# EAGLE schematic AnalogLedFader (EAGLE 6.4)
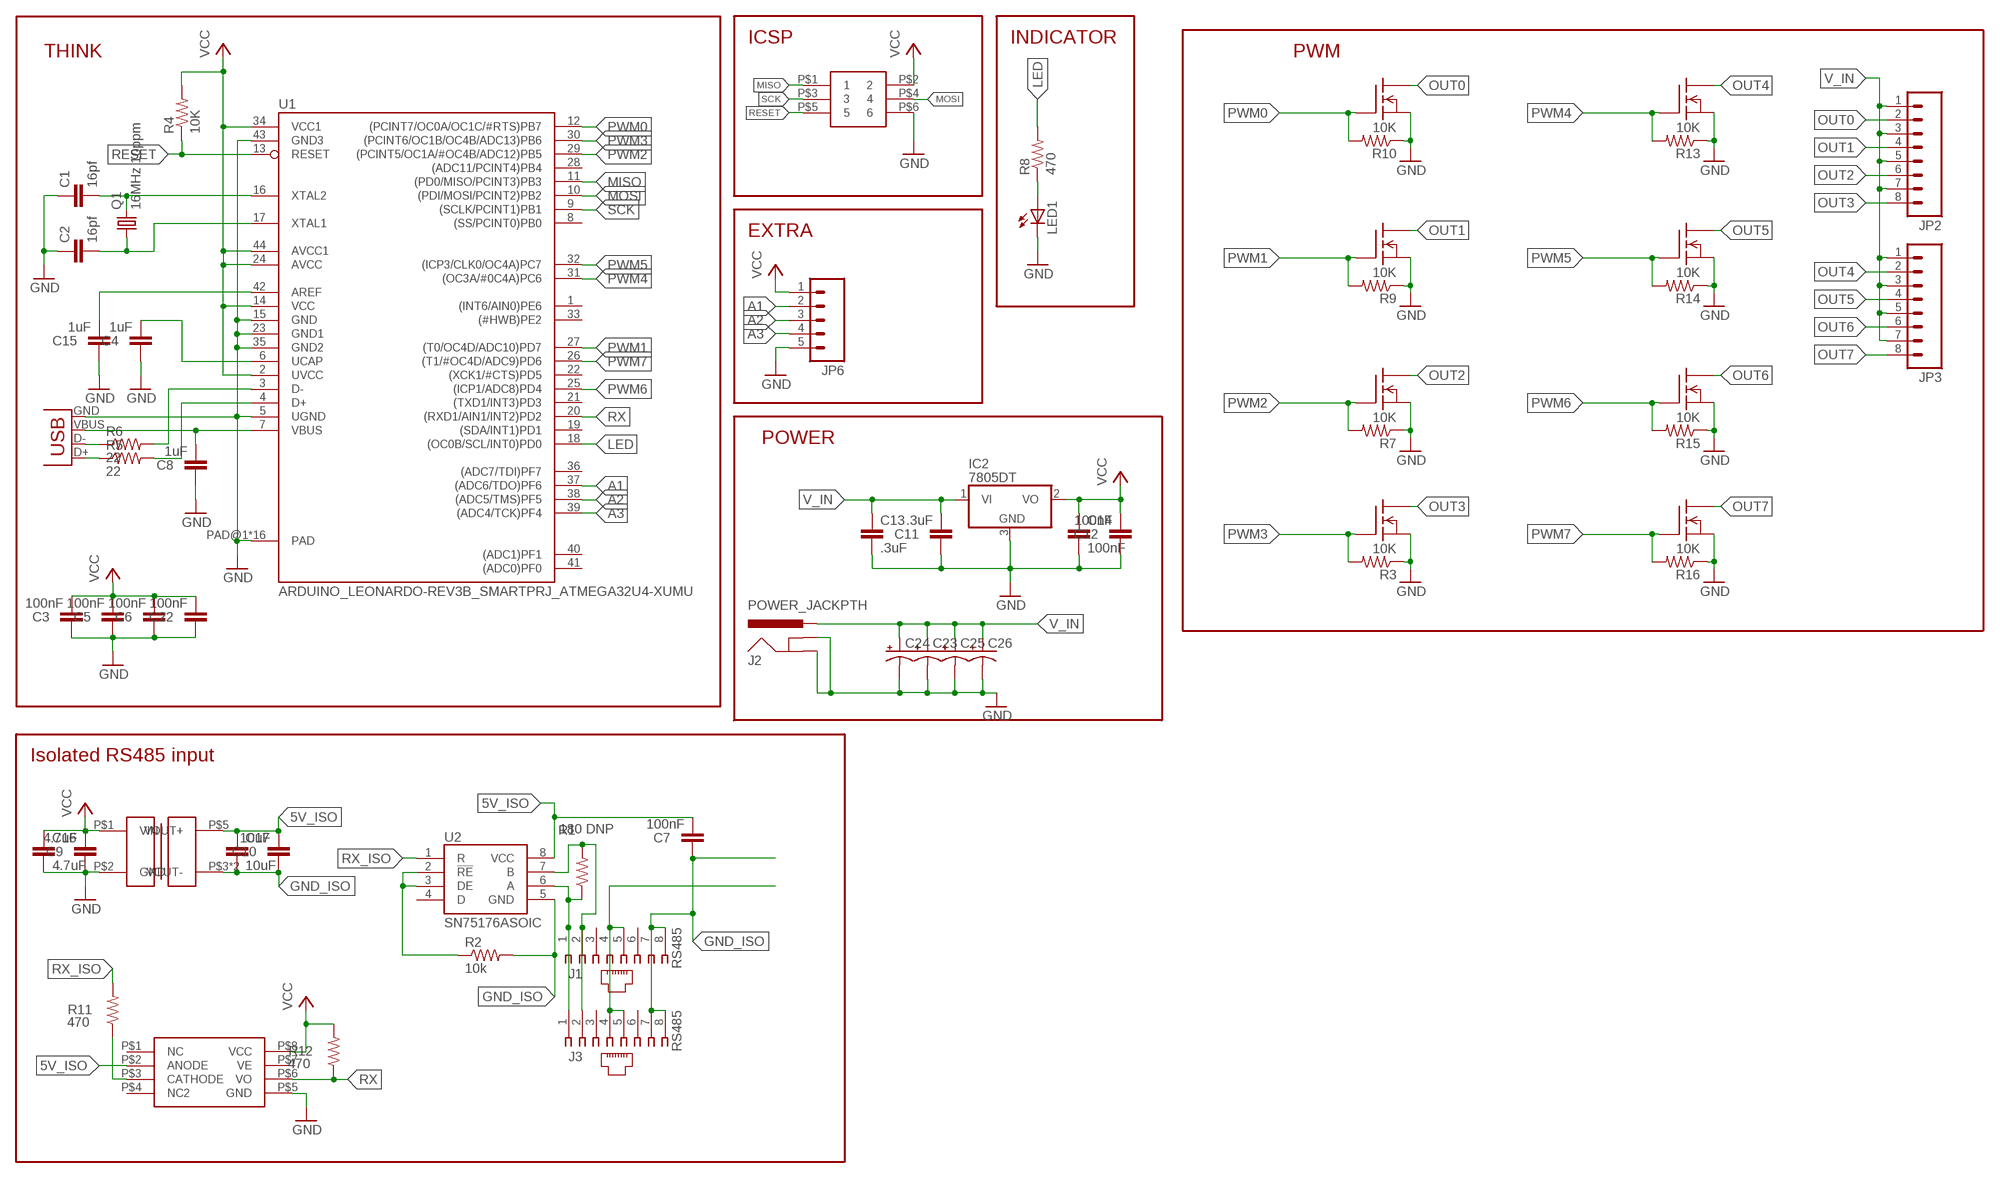
[diagram p0: schematic, sheet 1]

## Parts
C1  16pf  CAP0805  [0805]
C2  16pf  CAP0805  [0805]
C3  100nF  CAP0805  [0805]
C4  1uF  CAP0805  [0805]
C5  100nF  CAP0805  [0805]
C6  100nF  CAP0805  [0805]
C7  100nF  CAP0805  [0805]
C8  1uF  CAP0805  [0805]
C9  4.7uF  CAP0805  [0805]
C10  10uF  CAP0805  [0805]
C11  .3uF  CAP0805  [0805]
C12  100nF  CAP0805  [0805]
C13  .3uF  CAP1210  [1210]
C14  100nF  CAP1210  [1210]
C15  1uF  CAP0805  [0805]
C16  4.7uF  CAP1210  [1210]
C17  10uF  CAP1210  [1210]
C22  100nF  CAP0805  [0805]
C23  CAP_POLE  [PANASONIC_E]
C24  CAP_POLE  [PANASONIC_E]
C25  CAP_POLE  [PANASONIC_E]
C26  CAP_POLE  [PANASONIC_E]
IC2  7805DT  [TO252]
J1  RS485  520426-4  [520426-4]
J2  POWER_JACKPTH  [POWER_JACK_PTH]
J3  RS485  520426-4  [520426-4]
JP2  M083.5MM-8  [SCREWTERMINAL-3.5MM-8]
JP3  M083.5MM-8  [SCREWTERMINAL-3.5MM-8]
JP6  M05PTH  [1X05]
LED1  LED5MM  [LED5MM]
Q1  16MHz 10ppm  CRYSTAL  [XS3225]
R1  180 DNP  RESISTOR  [0805]
R2  10k  RESISTOR  [0805]
R3  10K  RESISTOR  [0805]
R4  10K  RESISTOR  [0805]
R5  22  RESISTOR  [0805]
R6  22  RESISTOR  [0805]
R7  10K  RESISTOR  [0805]
R8  470  RESISTOR  [0805]
R9  10K  RESISTOR  [0805]
R10  10K  RESISTOR  [0805]
R11  470  RESISTOR  [0805]
R12  470  RESISTOR  [0805]
R13  10K  RESISTOR  [0805]
R14  10K  RESISTOR  [0805]
R15  10K  RESISTOR  [0805]
R16  10K  RESISTOR  [0805]
U1  ARDUINO_LEONARDO-REV3B_SMARTPRJ_ATMEGA32U4-XUMU  [ARDUINO_LEONARDO-REV3B_SMARTPRJ_QFN44ML7X7]
U2  SN75176ASOIC  [SO08]
U$1  N_MOSFET  [TO252]
U$2  2X3HEADER  [2X3HEADER]
U$3  N_MOSFET  [TO252]
U$4  N_MOSFET  [TO252]
U$5  N_MOSFET  [TO252]
U$6  N_MOSFET  [TO252]
U$7  N_MOSFET  [TO252]
U$8  N_MOSFET  [TO252]
U$9  N_MOSFET  [TO252]
U$10  DC_DC_ISOLATED_0505  [IB_XLS-1W]
U$12  6N137  [8_SOIC]
X1  USBPTH  [USB-B-PTH]

## Nets
5V_ISO [power]: C7.2 C10.2 C17.1 U2.8(VCC) U$10.P$5(VOUT+) U$12.P$2(ANODE)
A1: JP6.2 U1.37((ADC6/TDO)PF6)
A2: JP6.3 U1.38((ADC5/TMS)PF5)
A3: JP6.4 U1.39((ADC4/TCK)PF4)
CONNECT_ME: R2.1 U2.2(!RE) U2.3(DE)
GND [power]: C1.1 C2.1 C3.1 C4.1 C5.1 C6.1 C8.1 C9.1 C11.1 C12.1 C13.2 C14.2 C15.1 C16.2 C22.1 C23.- C24.- C25.- C26.- IC2.3(GND) J2.GND J2.GNDBREAK JP6.5 LED1.K(C) R3.1 R7.1 R9.1 R10.1 R13.1 R14.1 R15.1 R16.1 U1.5(UGND) U1.15(GND) U1.23(GND1) U1.35(GND2) U1.43(GND3) U1.PAD@1(PAD) U1.PAD@2(PAD) U1.PAD@3(PAD) U1.PAD@4(PAD) U1.PAD@5(PAD) U1.PAD@6(PAD) U1.PAD@7(PAD) U1.PAD@8(PAD) U1.PAD@9(PAD) U1.PAD@10(PAD) U1.PAD@11(PAD) U1.PAD@12(PAD) U1.PAD@13(PAD) U1.PAD@14(PAD) U1.PAD@15(PAD) U1.PAD@16(PAD) U$1.P$2(S) U$2.P$6 U$3.P$2(S) U$4.P$2(S) U$5.P$2(S) U$6.P$2(S) U$7.P$2(S) U$8.P$2(S) U$9.P$2(S) U$10.P$2(GND) U$12.P$5(GND) X1.GND
GND_ISO [power]: C7.1 C10.1 C17.2 J1.7 J1.8 J3.7 J3.8 R2.2 U2.5(GND) U$10.P$3(VOUT-) U$10.P$4(VOUT-)
LED: R8.2 U1.18((OC0B/SCL/INT0)PD0)
MISO: U1.11((PD0/MISO/PCINT3)PB3) U$2.P$1
MOSI: U1.10((PDI/MOSI/PCINT2)PB2) U$2.P$4
N$1: R6.1 X1.D-
N$2: C1.2 Q1.P$3 U1.16(XTAL2)
N$3: R5.1 X1.D+
N$4: R5.2 U1.4(D+)
N$5: C2.2 Q1.P$1 U1.17(XTAL1)
N$6: R6.2 U1.3(D-)
N$8: LED1.A R8.1
N$9: C4.2 U1.6(UCAP)
N$10: C8.2 U1.7(VBUS) X1.VBUS
N$11: C15.2 U1.42(AREF)
N$14: R11.1 U$12.P$3(CATHODE)
OUT0: JP2.2 U$1.P$3(D)
OUT1: JP2.4 U$3.P$3(D)
OUT2: JP2.6 U$4.P$3(D)
OUT3: JP2.8 U$5.P$3(D)
OUT4: JP3.2 U$6.P$3(D)
OUT5: JP3.4 U$7.P$3(D)
OUT6: JP3.6 U$8.P$3(D)
OUT7: JP3.8 U$9.P$3(D)
PWM0: R10.2 U1.12((PCINT7/OC0A/OC1C/#RTS)PB7) U$1.P$1(G)
PWM1: R9.2 U1.27((T0/OC4D/ADC10)PD7) U$3.P$1(G)
PWM2: R7.2 U1.29((PCINT5/OC1A/#OC4B/ADC12)PB5) U$4.P$1(G)
PWM3: R3.2 U1.30((PCINT6/OC1B/OC4B/ADC13)PB6) U$5.P$1(G)
PWM4: R13.2 U1.31((OC3A/#0C4A)PC6) U$6.P$1(G)
PWM5: R14.2 U1.32((ICP3/CLK0/OC4A)PC7) U$7.P$1(G)
PWM6: R15.2 U1.25((ICP1/ADC8)PD4) U$8.P$1(G)
PWM7: R16.2 U1.26((T1/#OC4D/ADC9)PD6) U$9.P$1(G)
RESET: R4.1 U1.13(RESET) U$2.P$5
RS485A: J1.1 J3.1 R1.1 U2.6(A)
RS485B: J1.2 J3.2 R1.2 U2.7(B)
RX: R12.1 U1.20((RXD1/AIN1/INT2)PD2) U$12.P$6(VO)
RX_ISO: R11.2 U2.1(R)
SCK: U1.9((SCLK/PCINT1)PB1) U$2.P$3
V_IN [power]: C11.2 C13.1 C23.+ C24.+ C25.+ C26.+ IC2.1(VI) J2.PWR JP2.1 JP2.3 JP2.5 JP2.7 JP3.1 JP3.3 JP3.5 JP3.7
VCC: C3.2 C5.2 C6.2 C9.2 C12.2 C14.1 C16.1 C22.2 IC2.2(VO) JP6.1 R4.2 R12.2 U1.2(UVCC) U1.14(VCC) U1.24(AVCC) U1.34(VCC1) U1.44(AVCC1) U$2.P$2 U$10.P$1(VIN) U$12.P$8(VCC)
VMOT: J1.4 J1.5 J3.4 J3.5
Unconnected: J1.3 J1.6 J3.3 J3.6 U1.1((INT6/AIN0)PE6) U1.8((SS/PCINT0)PB0) U1.19((SDA/INT1)PD1) U1.21((TXD1/INT3)PD3) U1.22((XCK1/#CTS)PD5) U1.28((ADC11/PCINT4)PB4) U1.33((#HWB)PE2) U1.36((ADC7/TDI)PF7) U1.40((ADC1)PF1) U1.41((ADC0)PF0) U2.4(D) U$12.P$1(NC) U$12.P$4(NC2) U$12.P$7(VE)

## Notes on the sheet
- ICSP | INDICATOR
- THINK | PWM
- EXTRA
- POWER
- Isolated RS485 input

## Library data of the parts
C1-C17 C22 = SparkFun:CAP: Capacitor Standard 0603 ceramic capacitor, and 0.1" leaded capacitor.
C23-C26 = SparkFun:CAP_POL: Capacitor Polarized These are standard SMD and PTH capacitors. Normally 10uF, 47uF, and 100uF in electrolytic and tantalum varieties. Always verify the external diameter of the through hole cap, it varies with capacity, voltage, and manufacturer. The EIA devices should be standard.
IC2 = linear:78*: Positive VOLTAGE REGULATOR Source: http://cache.national.com/ds/LM/LM78L05.pdf http://www.fairchildsemi.com/ds/LM/LM7805.pdf
J1 J3 = con-amp:520426-4: AMP connector
J2 = SparkFun:POWER_JACK: Power Jack This is the standard 5.5mm barrel jack for power. The PTH is the most common, proven, reliable, footprint. All others are experimental. The Slot footprint only works if the mill layer is transmitted to the PCB fab house so be warned. Spark Fun Electronics SKU : PRT-00119. Mating wall wart : TOL-00298 (and others)
JP2 JP3 = SparkFun:M08: Header 8 Standard 8-pin 0.1" header. Use with straight break away headers (SKU : PRT-00116), right angle break away headers (PRT-00553), swiss pins (PRT-00743), machine pins (PRT-00117), and female headers (PRT-00115).
JP6 = SparkFun:M05: Header 5 Standard 5-pin 0.1" header. Use with straight break away headers (SKU : PRT-00116), right angle break away headers (PRT-00553), swiss pins (PRT-00743), machine pins (PRT-00117), and female headers (PRT-00115). Molex polarized connector foot print use with SKU : PRT-08230 with associated crimp pins and housings.
LED1 = SparkFun:LED: LEDs Standard schematic elements and footprints for 5mm, 3mm, 1206, and 0603 sized LEDs. 5mm - Spark Fun Electronics SKU : COM-00529 (and others)
Q1 = blinkyboard:CRYSTAL: CRYSTAL
R1-R16 = SparkFun:RESISTOR: Resistor Basic schematic elements and footprints for 0603, 1206, and PTH 1/10th watt (small) resistors.
U1 = blinkinlabs:ARDUINO_LEONARDO-REV3B_SMARTPRJ_ATMEGA32U4-XU
U2 = reprap:SN75176A
U$1 U$3-U$9 = blinkinlabs:N_MOSFET
U$2 = sonos_library:2X3HEADER
U$10 = blinkinlabs:DC_DC_ISOLATED_0505: Galvanicly isolated 5v:5v converter. Could be a
U$12 = sonos_library:6N137
X1 = SparkFun:USB: USB Connectors USB-B-PTH is fully proven SKU : PRT-00139 USB-miniB is fully proven SKU : PRT-00587 USB-A-PCB is untested. USB-A-H is throughly reviewed, but untested. Spark Fun Electronics SKU : PRT-00437 USB-B-SMT is throughly reviewed, but untested. Needs silkscreen touching up. USB-A-S has not been used/tested USB-MB-H has not been used/tested

## Net classes
0 default: width 0.254 mm
1 power: width 0.406 mm
2 motors: width 0.61 mm